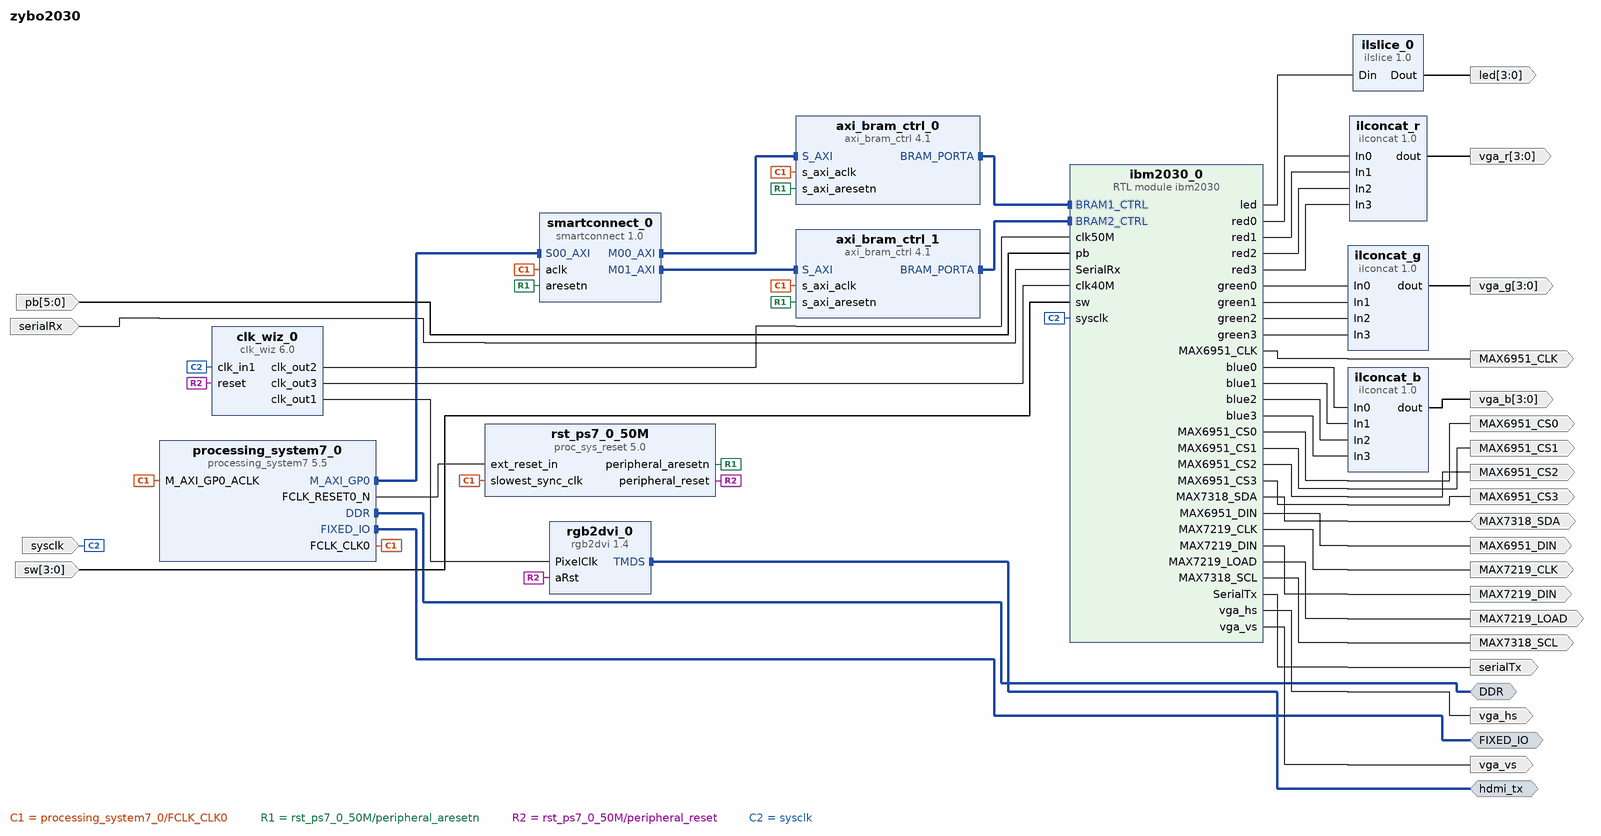
[diagram p0: block diagram of the top level]
# Vivado block design zybo2030, xc7z020clg400-1, Vivado 2025.2
create_bd_design zybo2030

create_bd_intf_port -mode Master -vlnv xilinx.com:interface:ddrx_rtl:1.0 DDR
create_bd_intf_port -mode Master -vlnv xilinx.com:display_processing_system7:fixedio_rtl:1.0 FIXED_IO
create_bd_intf_port -mode Master -vlnv digilentinc.com:interface:tmds_rtl:1.0 hdmi_tx
create_bd_port -dir I -from 5 -to 0 pb
create_bd_port -dir I -from 3 -to 0 sw
create_bd_port -dir O -from 3 -to 0 led
create_bd_port -dir O vga_hs
create_bd_port -dir O vga_vs
create_bd_port -dir O MAX7318_SCL
create_bd_port -dir O MAX7219_CLK
create_bd_port -dir IO MAX7318_SDA
create_bd_port -dir O MAX7219_LOAD
create_bd_port -dir O MAX7219_DIN
create_bd_port -dir O MAX6951_CLK
create_bd_port -dir O MAX6951_CS0
create_bd_port -dir O MAX6951_CS1
create_bd_port -dir O MAX6951_CS2
create_bd_port -dir O MAX6951_CS3
create_bd_port -dir O MAX6951_DIN
create_bd_port -dir I -type clk sysclk
set_property -dict {CONFIG.FREQ_HZ 125000000} [get_bd_ports sysclk]
create_bd_port -dir O -from 3 -to 0 vga_b
create_bd_port -dir O -from 3 -to 0 vga_r
create_bd_port -dir O -from 3 -to 0 vga_g
create_bd_port -dir I serialRx
create_bd_port -dir O serialTx

create_bd_cell -type module -reference ibm2030 ibm2030_0
create_bd_cell -type ip -vlnv xilinx.com:ip:axi_bram_ctrl:4.1 axi_bram_ctrl_1
set_property -dict {CONFIG.PROTOCOL AXI4LITE CONFIG.SINGLE_PORT_BRAM 1} [get_bd_cells axi_bram_ctrl_1]
create_bd_cell -type ip -vlnv xilinx.com:ip:processing_system7:5.5 processing_system7_0
# 1 more settings of processing_system7_0 are not shown: defaults, MIO pin electricals, DDR timing, and values the tool derives
create_bd_cell -type ip -vlnv xilinx.com:ip:clk_wiz:6.0 clk_wiz_0
set_property -dict [list \
  CONFIG.AXI_DRP false \
  CONFIG.CLKIN1_JITTER_PS 80.0 \
  CONFIG.CLKOUT1_DRIVES BUFGCE \
  CONFIG.CLKOUT1_JITTER 119.348 \
  CONFIG.CLKOUT1_PHASE_ERROR 96.948 \
  CONFIG.CLKOUT1_REQUESTED_OUT_FREQ 125 \
  CONFIG.CLKOUT1_USED true \
  CONFIG.CLKOUT2_DRIVES BUFGCE \
  CONFIG.CLKOUT2_JITTER 143.688 \
  CONFIG.CLKOUT2_PHASE_ERROR 96.948 \
  CONFIG.CLKOUT2_REQUESTED_OUT_FREQ 50 \
  CONFIG.CLKOUT2_USED true \
  CONFIG.CLKOUT3_DRIVES BUFGCE \
  CONFIG.CLKOUT3_JITTER 150.675 \
  CONFIG.CLKOUT3_PHASE_ERROR 96.948 \
  CONFIG.CLKOUT3_REQUESTED_OUT_FREQ 40 \
  CONFIG.CLKOUT3_USED true \
  CONFIG.CLKOUT4_DRIVES BUFGCE \
  CONFIG.CLKOUT5_DRIVES BUFGCE \
  CONFIG.CLKOUT6_DRIVES BUFGCE \
  CONFIG.CLKOUT7_DRIVES BUFGCE \
  CONFIG.FEEDBACK_SOURCE FDBK_AUTO \
  CONFIG.MMCM_BANDWIDTH OPTIMIZED \
  CONFIG.MMCM_CLKFBOUT_MULT_F 8.000 \
  CONFIG.MMCM_CLKIN1_PERIOD 8.000 \
  CONFIG.MMCM_CLKIN2_PERIOD 10.000 \
  CONFIG.MMCM_CLKOUT0_DIVIDE_F 8.000 \
  CONFIG.MMCM_CLKOUT1_DIVIDE 20 \
  CONFIG.MMCM_CLKOUT2_DIVIDE 25 \
  CONFIG.MMCM_COMPENSATION ZHOLD \
  CONFIG.NUM_OUT_CLKS 3 \
  CONFIG.OVERRIDE_MMCM false \
  CONFIG.PHASE_DUTY_CONFIG false \
  CONFIG.PRIMITIVE MMCM \
  CONFIG.PRIM_SOURCE Single_ended_clock_capable_pin \
  CONFIG.SECONDARY_SOURCE Single_ended_clock_capable_pin \
  CONFIG.USE_DYN_PHASE_SHIFT false \
  CONFIG.USE_DYN_RECONFIG false \
  CONFIG.USE_LOCKED false \
  CONFIG.USE_PHASE_ALIGNMENT false \
  CONFIG.USE_SAFE_CLOCK_STARTUP true \
] [get_bd_cells clk_wiz_0]
create_bd_cell -type ip -vlnv xilinx.com:ip:proc_sys_reset:5.0 rst_ps7_0_50M
set_property -dict {CONFIG.C_AUX_RST_WIDTH 1 CONFIG.C_EXT_RST_WIDTH 1} [get_bd_cells rst_ps7_0_50M]
create_bd_cell -type inline_hdl -vlnv xilinx.com:inline_hdl:ilconcat:1.0 ilconcat_r
set_property -dict {CONFIG.NUM_PORTS 4} [get_bd_cells ilconcat_r]
create_bd_cell -type inline_hdl -vlnv xilinx.com:inline_hdl:ilconcat:1.0 ilconcat_g
set_property -dict {CONFIG.NUM_PORTS 4} [get_bd_cells ilconcat_g]
create_bd_cell -type inline_hdl -vlnv xilinx.com:inline_hdl:ilconcat:1.0 ilconcat_b
set_property -dict {CONFIG.NUM_PORTS 4} [get_bd_cells ilconcat_b]
create_bd_cell -type ip -vlnv xilinx.com:ip:smartconnect:1.0 smartconnect_0
set_property -dict {CONFIG.NUM_MI 2 CONFIG.NUM_SI 1} [get_bd_cells smartconnect_0]
create_bd_cell -type inline_hdl -vlnv xilinx.com:inline_hdl:ilslice:1.0 ilslice_0
set_property -dict {CONFIG.DIN_FROM 3 CONFIG.DIN_TO 0 CONFIG.DIN_WIDTH 5} [get_bd_cells ilslice_0]
create_bd_cell -type ip -vlnv xilinx.com:ip:axi_bram_ctrl:4.1 axi_bram_ctrl_0
set_property -dict {CONFIG.PROTOCOL AXI4LITE CONFIG.SINGLE_PORT_BRAM 1} [get_bd_cells axi_bram_ctrl_0]
create_bd_cell -type ip -vlnv digilentinc.com:ip:rgb2dvi:1.4 rgb2dvi_0

# ---- connections ----

connect_bd_intf_net [get_bd_intf_pins axi_bram_ctrl_0/BRAM_PORTA] [get_bd_intf_pins ibm2030_0/BRAM1_CTRL]
connect_bd_intf_net [get_bd_intf_pins axi_bram_ctrl_1/BRAM_PORTA] [get_bd_intf_pins ibm2030_0/BRAM2_CTRL]
connect_bd_intf_net [get_bd_intf_ports DDR] [get_bd_intf_pins processing_system7_0/DDR]
connect_bd_intf_net [get_bd_intf_ports FIXED_IO] [get_bd_intf_pins processing_system7_0/FIXED_IO]
connect_bd_intf_net [get_bd_intf_pins processing_system7_0/M_AXI_GP0] [get_bd_intf_pins smartconnect_0/S00_AXI]
connect_bd_intf_net [get_bd_intf_ports hdmi_tx] [get_bd_intf_pins rgb2dvi_0/TMDS]
connect_bd_intf_net [get_bd_intf_pins smartconnect_0/M00_AXI] [get_bd_intf_pins axi_bram_ctrl_0/S_AXI]
connect_bd_intf_net [get_bd_intf_pins smartconnect_0/M01_AXI] [get_bd_intf_pins axi_bram_ctrl_1/S_AXI]
connect_bd_net [get_bd_ports MAX7318_SDA] [get_bd_pins ibm2030_0/MAX7318_SDA]
connect_bd_net [get_bd_pins clk_wiz_0/clk_out1] [get_bd_pins rgb2dvi_0/PixelClk]
connect_bd_net [get_bd_pins clk_wiz_0/clk_out2] [get_bd_pins ibm2030_0/clk50M]
connect_bd_net [get_bd_pins clk_wiz_0/clk_out3] [get_bd_pins ibm2030_0/clk40M]
connect_bd_net [get_bd_pins ibm2030_0/MAX6951_CLK] [get_bd_ports MAX6951_CLK]
connect_bd_net [get_bd_pins ibm2030_0/MAX6951_CS0] [get_bd_ports MAX6951_CS0]
connect_bd_net [get_bd_pins ibm2030_0/MAX6951_CS1] [get_bd_ports MAX6951_CS1]
connect_bd_net [get_bd_pins ibm2030_0/MAX6951_CS2] [get_bd_ports MAX6951_CS2]
connect_bd_net [get_bd_pins ibm2030_0/MAX6951_CS3] [get_bd_ports MAX6951_CS3]
connect_bd_net [get_bd_pins ibm2030_0/MAX6951_DIN] [get_bd_ports MAX6951_DIN]
connect_bd_net [get_bd_pins ibm2030_0/MAX7219_CLK] [get_bd_ports MAX7219_CLK]
connect_bd_net [get_bd_pins ibm2030_0/MAX7219_DIN] [get_bd_ports MAX7219_DIN]
connect_bd_net [get_bd_pins ibm2030_0/MAX7219_LOAD] [get_bd_ports MAX7219_LOAD]
connect_bd_net [get_bd_pins ibm2030_0/MAX7318_SCL] [get_bd_ports MAX7318_SCL]
connect_bd_net [get_bd_pins ibm2030_0/SerialTx] [get_bd_ports serialTx]
connect_bd_net [get_bd_pins ibm2030_0/blue0] [get_bd_pins ilconcat_b/In0]
connect_bd_net [get_bd_pins ibm2030_0/blue1] [get_bd_pins ilconcat_b/In1]
connect_bd_net [get_bd_pins ibm2030_0/blue2] [get_bd_pins ilconcat_b/In2]
connect_bd_net [get_bd_pins ibm2030_0/blue3] [get_bd_pins ilconcat_b/In3]
connect_bd_net [get_bd_pins ibm2030_0/green0] [get_bd_pins ilconcat_g/In0]
connect_bd_net [get_bd_pins ibm2030_0/green1] [get_bd_pins ilconcat_g/In1]
connect_bd_net [get_bd_pins ibm2030_0/green2] [get_bd_pins ilconcat_g/In2]
connect_bd_net [get_bd_pins ibm2030_0/green3] [get_bd_pins ilconcat_g/In3]
connect_bd_net [get_bd_pins ibm2030_0/led] [get_bd_pins ilslice_0/Din]
connect_bd_net [get_bd_pins ibm2030_0/red0] [get_bd_pins ilconcat_r/In0]
connect_bd_net [get_bd_pins ibm2030_0/red1] [get_bd_pins ilconcat_r/In1]
connect_bd_net [get_bd_pins ibm2030_0/red2] [get_bd_pins ilconcat_r/In2]
connect_bd_net [get_bd_pins ibm2030_0/red3] [get_bd_pins ilconcat_r/In3]
connect_bd_net [get_bd_pins ibm2030_0/vga_hs] [get_bd_ports vga_hs]
connect_bd_net [get_bd_pins ibm2030_0/vga_vs] [get_bd_ports vga_vs]
connect_bd_net [get_bd_pins ilconcat_b/dout] [get_bd_ports vga_b]
connect_bd_net [get_bd_pins ilconcat_g/dout] [get_bd_ports vga_g]
connect_bd_net [get_bd_pins ilconcat_r/dout] [get_bd_ports vga_r]
connect_bd_net [get_bd_pins ilslice_0/Dout] [get_bd_ports led]
connect_bd_net [get_bd_ports pb] [get_bd_pins ibm2030_0/pb]
connect_bd_net [get_bd_pins processing_system7_0/FCLK_CLK0] \
  [get_bd_pins axi_bram_ctrl_0/s_axi_aclk] [get_bd_pins axi_bram_ctrl_1/s_axi_aclk] \
  [get_bd_pins rst_ps7_0_50M/slowest_sync_clk] [get_bd_pins processing_system7_0/M_AXI_GP0_ACLK] \
  [get_bd_pins smartconnect_0/aclk]
connect_bd_net [get_bd_pins processing_system7_0/FCLK_RESET0_N] [get_bd_pins rst_ps7_0_50M/ext_reset_in]
connect_bd_net [get_bd_pins rst_ps7_0_50M/peripheral_aresetn] \
  [get_bd_pins axi_bram_ctrl_0/s_axi_aresetn] [get_bd_pins axi_bram_ctrl_1/s_axi_aresetn] \
  [get_bd_pins smartconnect_0/aresetn]
connect_bd_net [get_bd_pins rst_ps7_0_50M/peripheral_reset] [get_bd_pins rgb2dvi_0/aRst] [get_bd_pins clk_wiz_0/reset]
connect_bd_net [get_bd_ports serialRx] [get_bd_pins ibm2030_0/SerialRx]
connect_bd_net [get_bd_ports sw] [get_bd_pins ibm2030_0/sw]
connect_bd_net [get_bd_ports sysclk] [get_bd_pins clk_wiz_0/clk_in1] [get_bd_pins ibm2030_0/sysclk]

# ---- address map ----
assign_bd_address -offset 0x40000000 -range 64K -target_address_space [get_bd_addr_spaces processing_system7_0/Data] [get_bd_addr_segs axi_bram_ctrl_0/S_AXI/Mem0]
assign_bd_address -offset 0x40020000 -range 2K -target_address_space [get_bd_addr_spaces processing_system7_0/Data] [get_bd_addr_segs axi_bram_ctrl_1/S_AXI/Mem0]

validate_bd_design
save_bd_design
